# Altium schematic sheet Sheet1.SchDoc
size A4; SheetNumber: 1; SheetTotal: 1
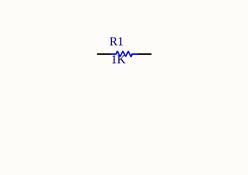
[diagram p0: Sheet1.SchDoc, top]
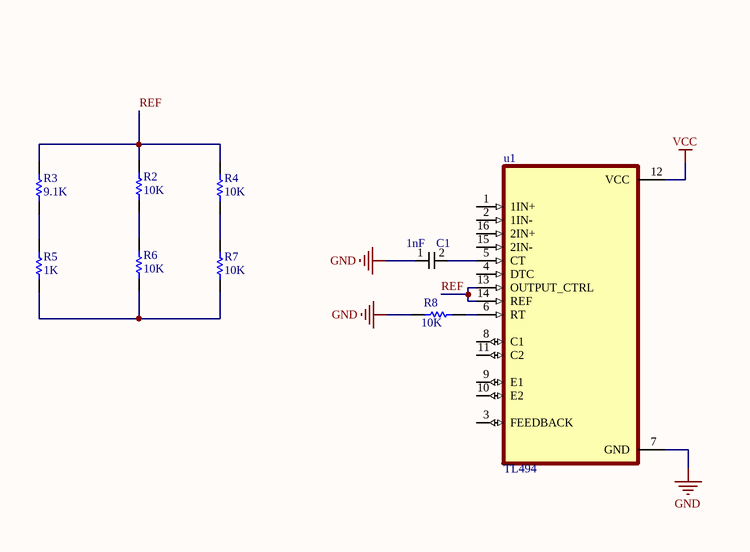
[diagram p1: Sheet1.SchDoc, bottom]

## Parts
C1  1nF  [ceramic capacitor]
R1  value 1K  [AXIAL-0.3]
R2  value 10K  [AXIAL-0.3]
R3  value 9.1K  [AXIAL-0.3]
R4  value 10K  [AXIAL-0.3]
R5  value 1K  [AXIAL-0.3]
R6  value 10K  [AXIAL-0.3]
R7  value 10K  [AXIAL-0.3]
R8  value 10K  [AXIAL-0.3]
u1  TL494  [DIP794W45P254L1969H508Q16]

## Nets
GND: C1.1 R8.1 u1.7(GND)
VCC: u1.12(VCC)
REF: R2.2 R3.2 R4.2 u1.13(OUTPUT_CTRL) u1.14(REF)
NetC1_2: C1.2 u1.5(CT)
NetR2_1: R2.1 R6.2
NetR3_1: R3.1 R5.2
NetR4_1: R4.1 R7.2
NetR5_1: R5.1 R6.1 R7.1
NetR8_2: R8.2 u1.6(RT)

Not connected (* = marked no-connect by the designer): R1 1 2; u1 1(1IN+) 2(1IN-) 3(FEEDBACK) 4(DTC) 8(C1) 9(E1) 10(E2) 11(C2) 15(2IN-) 16(2IN+)

## Library data of the parts
C1 = ceramic cpacitor
R1-R8 = Res1: Resistor; Published: 8-Jun-2000; LatestRevisionDate: 17-Jul-2002; LatestRevisionNote: Re-released for DXP Platform.; PackageReference: AXIAL-0.3; Publisher: Altium Limited; PackageDescription: Axial Device, Thru-Hole; 2 Leads; 0.3 in Pin Spacing
u1 = TL494INE THT